# Altium schematic sheet BEE_BOARD_USB_C_POLARITY.SchDoc
size Tabloid; DocumentNumber: 6; SheetNumber: 6; SheetTotal: 7; Sheet_Name: USB Polarity Check; Size: 11x17
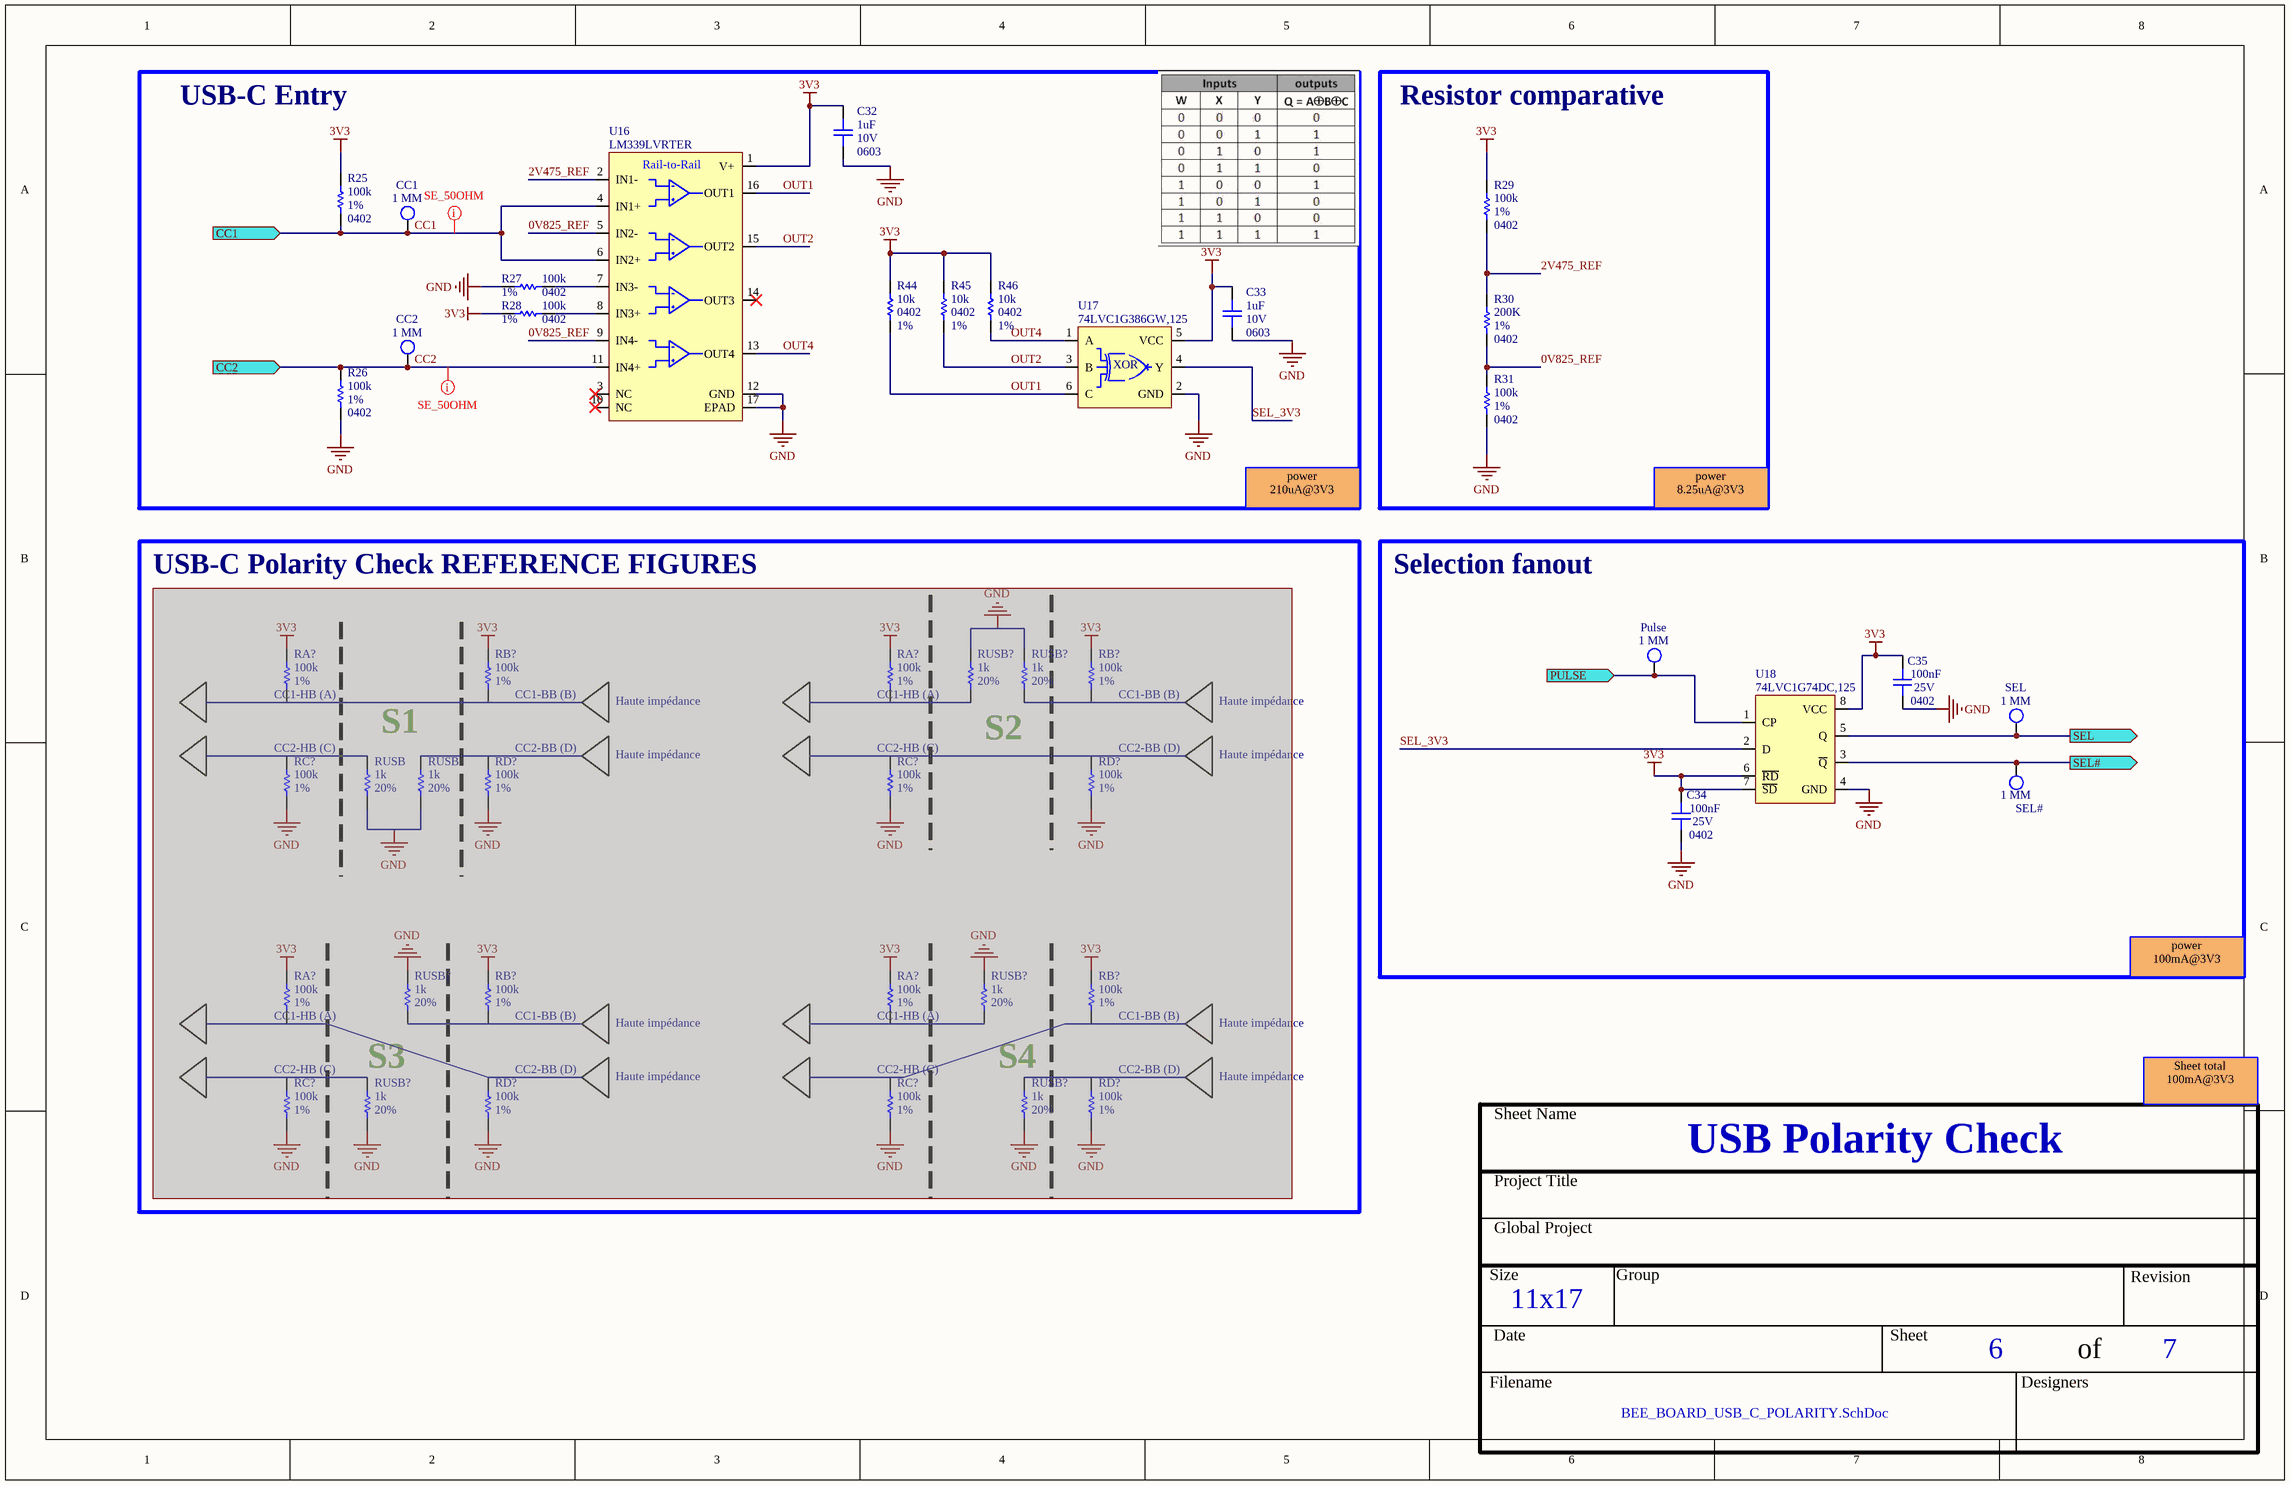
[diagram p0: BEE_BOARD_USB_C_POLARITY.SchDoc]

## Parts
(Parts that share a designator on the sheet are numbered #1, #2 ... from top to bottom, then left to right.)
C32  value 1uF  Package: 0603  Voltage Rating: 10V  [CAP_CER_0603]  (hidden comment: C0603C105K8PACTU)
C33  value 1uF  Package: 0603  Voltage Rating: 10V  [CAP_CER_0603]  (hidden comment: C0603C105K8PACTU)
C34  value 100nF  Package: 0402  Voltage Rating: 25V  [CAP_CER_0402]  (hidden comment: CGA2B3X7R1E104K050BB)
C35  value 100nF  Package: 0402  Voltage Rating: 25V  [CAP_CER_0402]  (hidden comment: CGA2B3X7R1E104K050BB)
CC1  1 MM  [TPO_SMD_ROUND_1MM]  (no BOM)
CC2  1 MM  [TPO_SMD_ROUND_1MM]  (no BOM)
Pulse  1 MM  [TPO_SMD_ROUND_1MM]  (no BOM)
R25  value 100k  Tolerance: 1%  Package: 0402  [RES_0402]  (hidden comment: RC0402FR-07100KL)
R26  value 100k  Tolerance: 1%  Package: 0402  [RES_0402]  (hidden comment: RC0402FR-07100KL)
R27  value 100k  Tolerance: 1%  Package: 0402  [RES_0402]  (hidden comment: RC0402FR-07100KL)
R28  value 100k  Tolerance: 1%  Package: 0402  [RES_0402]  (hidden comment: RC0402FR-07100KL)
R29  value 100k  Tolerance: 1%  Package: 0402  [RES_0402]  (hidden comment: RC0402FR-07100KL)
R30  value 200K  Tolerance: 1%  Package: 0402  [RES_0402]  (hidden comment: RMCF0402FT200K)
R31  value 100k  Tolerance: 1%  Package: 0402  [RES_0402]  (hidden comment: RC0402FR-07100KL)
R44  value 10k  Tolerance: 1%  Package: 0402  [RES_0402]  (hidden comment: RC0402FR-0710KL)
R45  value 10k  Tolerance: 1%  Package: 0402  [RES_0402]  (hidden comment: RC0402FR-0710KL)
R46  value 10k  Tolerance: 1%  Package: 0402  [RES_0402]  (hidden comment: RC0402FR-0710KL)
RA?#1  value 100k  Tolerance: 1%  [RES_0402]  (hidden comment: RC0402FR-07100KL)  (masked out: inside a compile mask, not in the netlist)
RA?#2  value 100k  Tolerance: 1%  [RES_0402]  (hidden comment: RC0402FR-07100KL)  (masked out: inside a compile mask, not in the netlist)
RA?#3  value 100k  Tolerance: 1%  [RES_0402]  (hidden comment: RC0402FR-07100KL)  (masked out: inside a compile mask, not in the netlist)
RA?#4  value 100k  Tolerance: 1%  [RES_0402]  (hidden comment: RC0402FR-07100KL)  (masked out: inside a compile mask, not in the netlist)
RB?#1  value 100k  Tolerance: 1%  [RES_0402]  (hidden comment: RC0402FR-07100KL)  (masked out: inside a compile mask, not in the netlist)
RB?#2  value 100k  Tolerance: 1%  [RES_0402]  (hidden comment: RC0402FR-07100KL)  (masked out: inside a compile mask, not in the netlist)
RB?#3  value 100k  Tolerance: 1%  [RES_0402]  (hidden comment: RC0402FR-07100KL)  (masked out: inside a compile mask, not in the netlist)
RB?#4  value 100k  Tolerance: 1%  [RES_0402]  (hidden comment: RC0402FR-07100KL)  (masked out: inside a compile mask, not in the netlist)
RC?#1  value 100k  Tolerance: 1%  [RES_0402]  (hidden comment: RC0402FR-07100KL)  (masked out: inside a compile mask, not in the netlist)
RC?#2  value 100k  Tolerance: 1%  [RES_0402]  (hidden comment: RC0402FR-07100KL)  (masked out: inside a compile mask, not in the netlist)
RC?#3  value 100k  Tolerance: 1%  [RES_0402]  (hidden comment: RC0402FR-07100KL)  (masked out: inside a compile mask, not in the netlist)
RC?#4  value 100k  Tolerance: 1%  [RES_0402]  (hidden comment: RC0402FR-07100KL)  (masked out: inside a compile mask, not in the netlist)
RD?#1  value 100k  Tolerance: 1%  [RES_0402]  (hidden comment: RC0402FR-07100KL)  (masked out: inside a compile mask, not in the netlist)
RD?#2  value 100k  Tolerance: 1%  [RES_0402]  (hidden comment: RC0402FR-07100KL)  (masked out: inside a compile mask, not in the netlist)
RD?#3  value 100k  Tolerance: 1%  [RES_0402]  (hidden comment: RC0402FR-07100KL)  (masked out: inside a compile mask, not in the netlist)
RD?#4  value 100k  Tolerance: 1%  [RES_0402]  (hidden comment: RC0402FR-07100KL)  (masked out: inside a compile mask, not in the netlist)
RUSB#1  value 1k  Tolerance: 20%  [RES_0402]  (hidden comment: ERA-2ARB102X)  (masked out: inside a compile mask, not in the netlist)
RUSB#2  value 1k  Tolerance: 20%  [RES_0402]  (hidden comment: ERA-2ARB102X)  (masked out: inside a compile mask, not in the netlist)
RUSB?#1  value 1k  Tolerance: 20%  [RES_0402]  (hidden comment: ERA-2ARB102X)  (masked out: inside a compile mask, not in the netlist)
RUSB?#2  value 1k  Tolerance: 20%  [RES_0402]  (hidden comment: ERA-2ARB102X)  (masked out: inside a compile mask, not in the netlist)
RUSB?#3  value 1k  Tolerance: 20%  [RES_0402]  (hidden comment: ERA-2ARB102X)  (masked out: inside a compile mask, not in the netlist)
RUSB?#4  value 1k  Tolerance: 20%  [RES_0402]  (hidden comment: ERA-2ARB102X)  (masked out: inside a compile mask, not in the netlist)
RUSB?#5  value 1k  Tolerance: 20%  [RES_0402]  (hidden comment: ERA-2ARB102X)  (masked out: inside a compile mask, not in the netlist)
RUSB?#6  value 1k  Tolerance: 20%  [RES_0402]  (hidden comment: ERA-2ARB102X)  (masked out: inside a compile mask, not in the netlist)
SEL  1 MM  [TPO_SMD_ROUND_1MM]  (no BOM)
SEL#  1 MM  [TPO_SMD_ROUND_1MM]  (no BOM)
U16  LM339LVRTER  [CMP_LM339LVRTER]
U17  74LVC1G386GW,125  [LOG_XOR_74LVC1G386GW,125]
U18  74LVC1G74DC,125  [LOG_FLIPFLOP_74LVC1G74DC,125]

## Blocks framed on the sheet
USB-C Entry: C32 C33 CC1 CC2 R25-R28 R44-R46 U16 U17
Resistor comparative: R29-R31
Selection fanout: C34 C35 Pulse SEL SEL# U18

## Ports
CC1 (in), CC2 (in), PULSE (in), SEL (out), SEL# (out)

## Nets
3V3: C32.1 C33.1 C34.2 C35.2 R25.2 R28.2 R29.2 R44.2 R45.2 R46.2 U16.1(V+) U17.5(VCC) U18.6(~{RD}) U18.7(~{SD}) U18.8(VCC)
GND: C32.2 C33.2 C34.1 C35.1 R26.1 R27.2 R31.1 U16.12(GND) U16.17(EPAD) U17.2(GND) U18.4(GND)
0V825_REF: R30.1 R31.2 U16.5(IN2-) U16.9(IN4-)
2V475_REF: R29.1 R30.2 U16.2(IN1-)
CC1: CC1.1 R25.1 U16.4(IN1+) U16.6(IN2+) ; port CC1
CC2: CC2.1 R26.2 U16.11(IN4+) ; port CC2
OUT1: R44.1 U16.16(OUT1) U17.6(C)
OUT2: R45.1 U16.15(OUT2) U17.3(B)
OUT4: R46.1 U16.13(OUT4) U17.1(A)
PULSE: Pulse.1 U18.1(CP) ; port PULSE
SEL: SEL.1 U18.5(Q) ; port SEL
SEL#: SEL#.1 U18.3(~{Q}) ; port SEL#
SEL_3V3: U17.4(Y) U18.2(D)
NetR27_1: R27.1 U16.7(IN3-)
NetR28_1: R28.1 U16.8(IN3+)

Not connected (* = marked no-connect by the designer): U16 3(NC)* 10(NC)* 14(OUT3)*

## Layout directives
net class SE_50OHM: CC1, CC2

## Notes on the sheet
- power
  210uA@3V3
- power
  8.25uA@3V3
- USB-C Polarity Check REFERENCE FIGURES
- (near RA?#1) CC1-HB (A)
- (near RB?#1) CC1-BB (B)
- Haute impédance
- (near RA?#2) CC1-HB (A)
- (near RB?#2) CC1-BB (B)
- (near RC?#1) CC2-HB (C)
- (near RUSB#2) S1
- (near RD?#1) CC2-BB (D)
- (near RC?#2) CC2-HB (C)
- (near RUSB?#2) S2
- (near RD?#2) CC2-BB (D)
- power
  100mA@3V3
- (near RA?#3) CC1-HB (A)
- (near RB?#3) CC1-BB (B)
- (near RA?#4) CC1-HB (A)
- (near RB?#4) CC1-BB (B)
- (near RC?#3) CC2-HB (C)
- (near RUSB?#5) S3
- (near RD?#3) CC2-BB (D)
- (near RC?#4) CC2-HB (C)
- (near RUSB?#6) S4
- (near RD?#4) CC2-BB (D)
- Sheet total
  100mA@3V3
- Sheet Name
- Project Title
- Global Project
- Size
- Group
- Revision
- Date
- Sheet
- of
- Filename
- Designers
- (in symbol CMP_LM339LVRTER) Rail-to-Rail
- (in symbol LOG_XOR_74LVC1G386GW,125) XOR

## Library data of the parts
C32 C33 = CAP_CER_C0603C105K8PACTU: CAP - CER 1uF 10V 10% X5R - 0603; Manufacturer #1: KEMET; GRAMS Lib Spec: 2.8; Magnetic Material: Unknown; Polarized: NO; Tolerance: 10%; Current Rating: *; Power Max: *; HelpURL: https://content.kemet.com/datasheets/KEM_C1006_X5R_SMD.pdf; CreatedBy/Date: Hubert Dube - 21/07/20; VerifiedBy: Louis-Daniel Gaulin - 21/07/20; Temperature: -55°C ~ 85°C; Manufacturer #2: *; Assembly Type: SMD; Part Number #2: *; Part Number #1: C0603C105K8PACTU; Cryo: UNKNOWN; Supplier 1: Digi-Key; Supplier Part Number 1: 399-3118-1-ND
C34 C35 = CAP_CER_CGA2B3X7R1E104K050BB: CAP - CER 0.1µF 10% 25V X7R - 0402; Manufacturer #1: TDK Corporation; GRAMS Lib Spec: 2.8; Magnetic Material: Unknown; Polarized: NO; Assembly Type: SMD; CreatedBy/Date: Nicolas Roy 2018-11-07; Current Rating: *; HelpURL: https://product.tdk.com/info/en/catalog/datasheets/mlcc_automotive_general_en.pdf; Manufacturer #2: *; Note: *; Part Number #1: CGA2B3X7R1E104K050BB; Part Number #2: *; Power Max: *; Temperature: -55°C ~ 125°C; Tolerance: 10%; VerifiedBy: Nicolas V. (2019-01-22); Supplier 1: Digi-Key; Supplier Part Number 1: 445-6902-1-ND; Cryo: UNKNOWN
CC1 CC2 Pulse SEL SEL# = TPO_SMD_ROUND_1MM: TPO - TEST POINT ROUND SMD PAD ONLY  - 1 MM; Magnetic Material: NO; GRAMS Lib Spec: 2.8; Cryo: UNKNOWN; Current Rating: *; Manufacturer #1: *; Manufacturer #2: *; Note: *; Power Max: *; Value: *; Part Number #1: *; Part Number #2: *; HelpURL: *; Polarized: *; Supplier 1: *; Assembly Type: NONE; Supplier Part Number 1: *; Package: 1 MM ROUND; CreatedBy/Date: Jonathan Bouchard 2018-07-17; Temperature: *; Tolerance: *; VerifiedBy: Arnaud Samson 23-07-18; Voltage Rating: *
R25-R29 R31 RA?#1-RA?#4 RB?#1-RB?#4 RC?#1-RC?#4 RD?#1-RD?#4 = RES_RC0402FR-07100KL: RES - 100K 1% 1/16W - 0402; Manufacturer #1: Yageo; GRAMS Lib Spec: 2.8; Magnetic Material: Unknown; Polarized: No; Voltage Rating: 50V; Assembly Type: SMD; CreatedBy/Date: Keven Deslandes 2018-10-19; Current Rating: *; HelpURL: http://www.yageo.com/documents/recent/PYu-RC_Group_51_RoHS_L_9.pdf; Manufacturer #2: *; Part Number #1: RC0402FR-07100KL; Part Number #2: *; Power Max: 1/16W; Temperature: -55°C ~ 155°C; VerifiedBy: Caroline Paulin - 18/12/2018; Supplier 1: Digi-Key; Supplier Part Number 1: 311-100KLRCT-ND; Cryo: UNKNOWN
R30 = RES_RMCF0402FT200K: RES -  200k ±1% 0.063W, 1/16W Chip Resistor 0402 (1005 Metric) Automotive AEC-Q200 Thick Film; Manufacturer #1: Stackpole Electronics Inc.; GRAMS Lib Spec: 2.8; Magnetic Material: Unknown; Polarized: No; Voltage Rating: 50V; Assembly Type: SMD; CreatedBy/Date: Philippe Arsenault/2021-04-14; Current Rating: *; HelpURL: https://www.seielect.com/catalog/sei-rmcf_rmcp.pdf; Manufacturer #2: *; Note: *; Part Number #1: RMCF0402FT200K; Part Number #2: *; Power Max: 1/16W; Temperature: -55°C ~ 155°C; VerifiedBy: Louis-Daniel Gaulin / 14-04-2021; Supplier 1: Digi-Key; Supplier Part Number 1: RMCF0402FT200KCT-ND
R44-R46 = RES_RC0402FR-0710KL: RES - 10K OHMS 1% 1/16W - 0402; Manufacturer #1: Yageo; GRAMS Lib Spec: 2.8; Magnetic Material: UNKNOWN; Polarized: NO; Voltage Rating: 50V; Assembly Type: SMD; CreatedBy/Date: Nicolas V. (2018-11-20); Current Rating: *; HelpURL: http://www.yageo.com/documents/recent/PYu-RC_Group_51_RoHS_L_9.pdf; Manufacturer #2: *; Note: *; Part Number #1: RC0402FR-0710KL; Part Number #2: *; Power Max: 1/16W; Temperature: -55°C ~ 155°C; VerifiedBy: Nicolas V. (2018-11-20); Supplier 1: Digi-Key; Supplier Part Number 1: 311-10.0KLRCT-ND; Cryo: UNKNOWN
RUSB#1 RUSB#2 RUSB?#1-RUSB?#6 = RES_ERA-2ARB102X: RES - 1K OHM 0.1% 1/16W - 0402; Manufacturer #1: Panasonic Electronic Components; GRAMS Lib Spec: 2.8; Magnetic Material: UNKNOWN; Polarized: NO; Voltage Rating: 50V; Assembly Type: SMD; CreatedBy/Date: Jonathan Bouchard 2018-07-06; Current Rating: *; HelpURL: https://industrial.panasonic.com/cdbs/www-data/pdf/RDM0000/AOA0000C307.pdf; Manufacturer #2: TE Connectivity Passive Product; Note: *; Part Number #1: ERA-2ARB102X; Part Number #2: RN73C1E1K0BTD; Power Max: 1/16W; Temperature: -55°C ~ 155°C; VerifiedBy: Arnaud Samson 16-07-18; Supplier 1: Digi-Key; Supplier Part Number 1: P1KCPCT-ND; Cryo: UNKNOWN
U16 = CMP_LM339LVRTER: COMP - Quad Comparator General Purpose Open-Drain, Rail-to-Rail - 16-WQFN (3x3); Manufacturer #1: Texas instrument; Voltage Rating: 1.65V ~ 5.5V; Current Rating: 100mA@5V (SC); GRAMS Lib Spec: 2.8; Magnetic Material: Unknown; Polarized: Yes; Power Max: -; HelpURL: https://www.ti.com/lit/ds/symlink/lm339lv.pdf?ts=1618013735062; CreatedBy/Date: Philippe Arsenault/2021-04-10; VerifiedBy: Louis-Daniel Gaulin / 14-04-2021; Temperature: -40°C ~ 125°C (TA); Package: 16-WFQFN Exposed Pad; Assembly Type: SMD; Part Number #1: LM339LVRTER; Supplier 1: Digi-Key; Supplier Part Number 1: 296-LM339LVRTERCT-ND
U17 = LOG_XOR_74LVC1G386GW,125: LOG -  XOR (Exclusive OR) IC 1 Channel 3 inputs- 6-TSSOP; Manufacturer #1: Nexperia USA Inc.; Value: XOR Gate 5V 3 in; Voltage Rating: 1.65V ~ 5.5V; Current Rating: 100mA (supply) , 50mA (out); Power Max: 250mW; GRAMS Lib Spec: 2.8; Magnetic Material: Unknown; Polarized: Yes; HelpURL: https://assets.nexperia.com/documents/data-sheet/74LVC1G386.pdf; CreatedBy/Date: Philippe Arsenault/2021-04-10; VerifiedBy: Louis-Daniel Gaulin / 14-04-2021; Temperature: -40°C ~ 125°C (TA); Package: 6-TSSOP; Assembly Type: SMD; Part Number #1: 74LVC1G386GW,125; Supplier 1: Digi-Key; Supplier Part Number 1: 1727-6982-1-ND
U18 = LOG_FLIPFLOP_74LVC1G74DC,125: LOG_FLIPFLOP - D-Type Flip Flop Bit Positive Edge with asynchronous operation - 8-VSSOP; Manufacturer #1: Nexperia USA Inc.; Voltage Rating: 1.65V ~ 5.5V; Current Rating: 32mA output; Power Max: 300mW; GRAMS Lib Spec: 2.8; Magnetic Material: Unknown; Polarized: Yes; HelpURL: https://assets.nexperia.com/documents/data-sheet/74LVC1G74.pdf; CreatedBy/Date: Philippe Arsenault/2021-04-14; VerifiedBy: Louis-Daniel Gaulin / 16-04-2021; Temperature: -40°C ~ 125°C (TA); Package: VSSOP-8; Assembly Type: SMD; Part Number #1: 74LVC1G74DC,125; Supplier 1: Digi-Key; Supplier Part Number 1: 1727-4029-1-ND